# EAGLE design wifi (EAGLE 6.1)
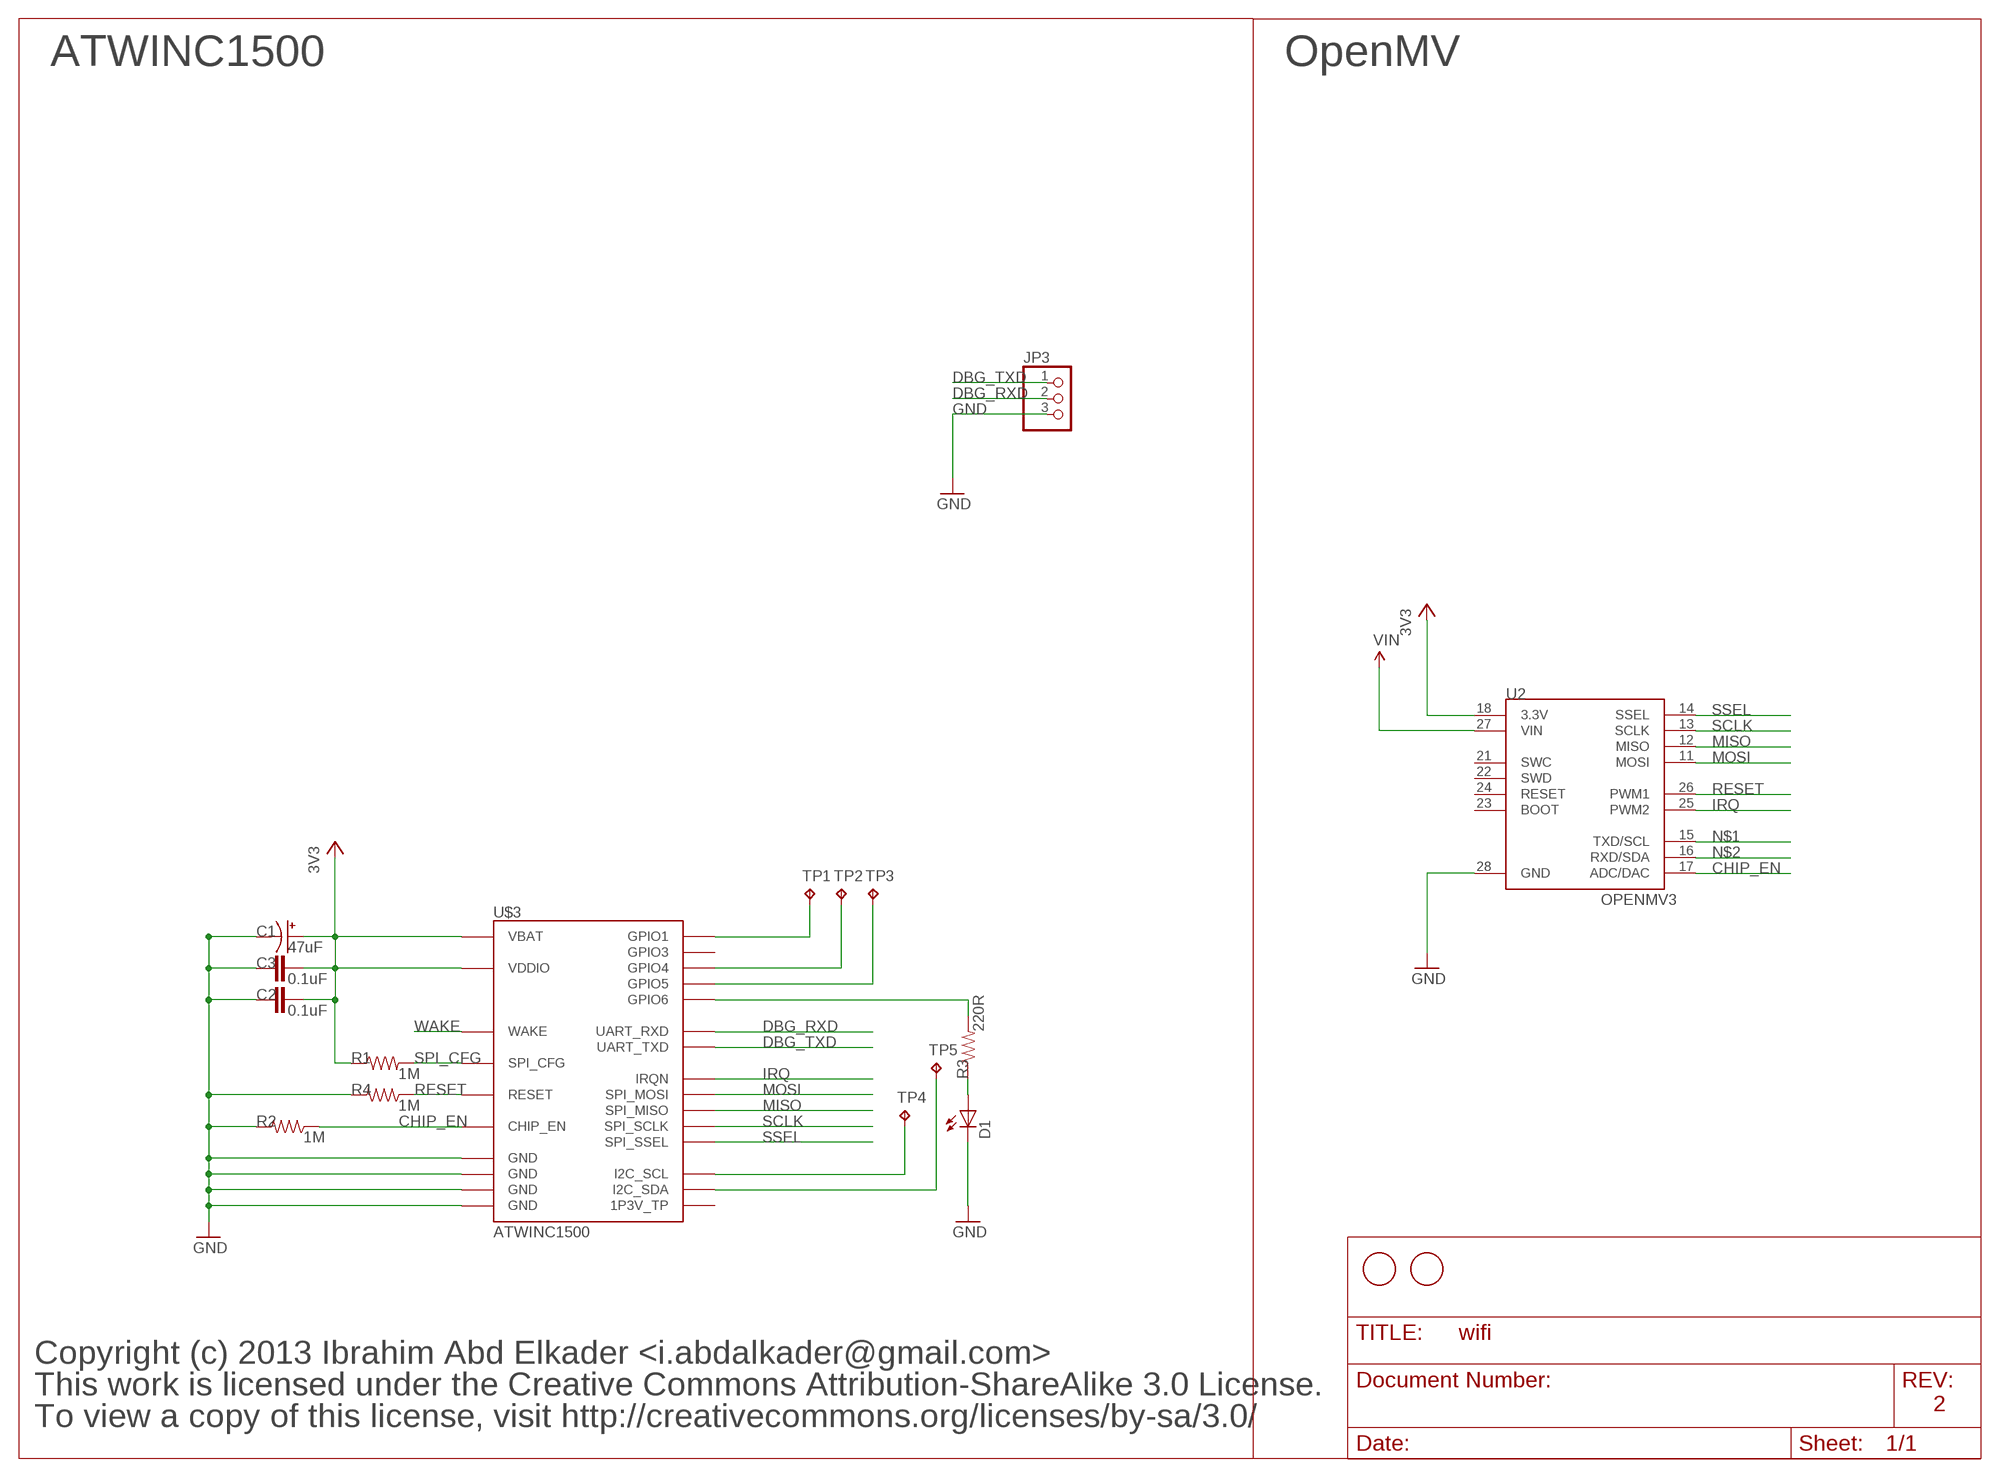
[diagram p0: schematic, sheet 1]

## Parts
C1  47uF  CAP_POL1206  [EIA3216]
C2  0.1uF  CAP0603-CAP  [0603-CAP]
C3  0.1uF  CAP0603-CAP  [0603-CAP]
D1  LED0603  [LED-0603]
JP3  PINHD-1X3  [1X03]
R1  1M  RESISTOR0603-RES  [0603-RES]
R2  1M  RESISTOR0603-RES  [0603-RES]
R3  220R  RESISTOR0603-RES  [0603-RES]
R4  1M  RESISTOR0603-RES  [0603-RES]
TP1  TPTP12R  [TP12R]
TP2  TPTP11R  [TP11R]
TP3  TPTP11R  [TP11R]
TP4  TPTP12R  [TP12R]
TP5  TPTP12R  [TP12R]
U2  OPENMV3  [OPENMV3]
U$1  FIDUCIAL  [FIDUCIAL_1MM]
U$2  FIDUCIAL  [FIDUCIAL_1MM]
U$3  ATWINC1500  [ATWINC1500]

## Nets
3V3: C1.A(+) C2.2 C3.2 R1.1 U2.18(3.3V) U$3.P$20(VBAT) U$3.P$23(VDDIO)
CHIP_EN: R2.1 U2.17(ADC/DAC) U$3.P$22(CHIP_EN)
DBG_RXD: JP3.2 U$3.P$19(UART_RXD)
DBG_TXD: JP3.1 U$3.P$14(UART_TXD)
GND: C1.C(-) C2.1 C3.1 D1.C JP3.3 R2.2 R4.2 U2.28(GND) U$3.P$9(GND) U$3.P$12(GND) U$3.P$28(GND) U$3.P$29(GND)
IRQ: U2.25(PWM2) U$3.P$13(IRQN)
MISO: U2.12(MISO) U$3.P$17(SPI_MISO)
MOSI: U2.11(MOSI) U$3.P$15(SPI_MOSI)
N$1: U2.15(TXD/SCL)
N$2: U2.16(RXD/SDA)
N$9: TP1.TP U$3.P$21(GPIO1)
N$10: TP4.TP U$3.P$2(I2C_SCL)
N$11: TP5.TP U$3.P$3(I2C_SDA)
N$12: D1.A R3.1
N$13: TP2.TP U$3.P$26(GPIO4)
N$14: TP3.TP U$3.P$27(GPIO5)
N$15: R3.2 U$3.P$1(GPIO6)
RESET: R4.1 U2.26(PWM1) U$3.P$4(RESET)
SCLK: U2.13(SCLK) U$3.P$18(SPI_SCLK)
SPI_CFG: R1.2 U$3.P$10(SPI_CFG)
SSEL: U2.14(SSEL) U$3.P$16(SPI_SSEL)
VIN: U2.27(VIN)
WAKE: U$3.P$11(WAKE)
Unconnected: U2.21(SWC) U2.22(SWD) U2.23(BOOT) U2.24(RESET) U$3.P$24(1P3V_TP) U$3.P$25(GPIO3)

## Notes on the sheet
- ATWINC1500 | OpenMV
- Copyright (c) 2013 Ibrahim Abd Elkader <i.abdalkader@gmail.com>
- This work is licensed under the Creative Commons Attribution-ShareAlike 3.0 License.
- 2
- To view a copy of this license, visit http://creativecommons.org/licenses/by-sa/3.0/

## Library data of the parts
C1 = sfe:CAP_POL: Capacitor Polarized These are standard SMD and PTH capacitors. Normally 10uF, 47uF, and 100uF in electrolytic and tantalum varieties. Always verify the external diameter of the through hole cap, it varies with capacity, voltage, and manufacturer. The EIA devices should be standard.
C2 C3 = sfe:CAP: Capacitor Standard 0603 ceramic capacitor, and 0.1" leaded capacitor.
D1 = sfe:LED: LEDs Standard schematic elements and footprints for 5mm, 3mm, 1206, and 0603 sized LEDs. 5mm - Spark Fun Electronics SKU : COM-00529 (and others)
JP3 = adafruit-updated:PINHD-1X3: PIN HEADER
R1-R4 = sfe:RESISTOR: Resistor Basic schematic elements and footprints for 0603, 1206, and PTH resistors.
TP1-TP5 = testpad:TP: Test pad
U2 = openmv:OPENMV3
U$1 U$2 = adafruit:FIDUCIAL: For use by pick and place machines to calibrate the vision/machine, 1mm By microbuilder.eu
U$3 = mux:ATWINC1500

## Net classes
1 vcc: width 1.016 mm, clearance 0.203 mm
2 antenna: width 0.363 mm, clearance 0.305 mm
3 1.8v: width 0.457 mm, clearance 0.254 mm

## Board
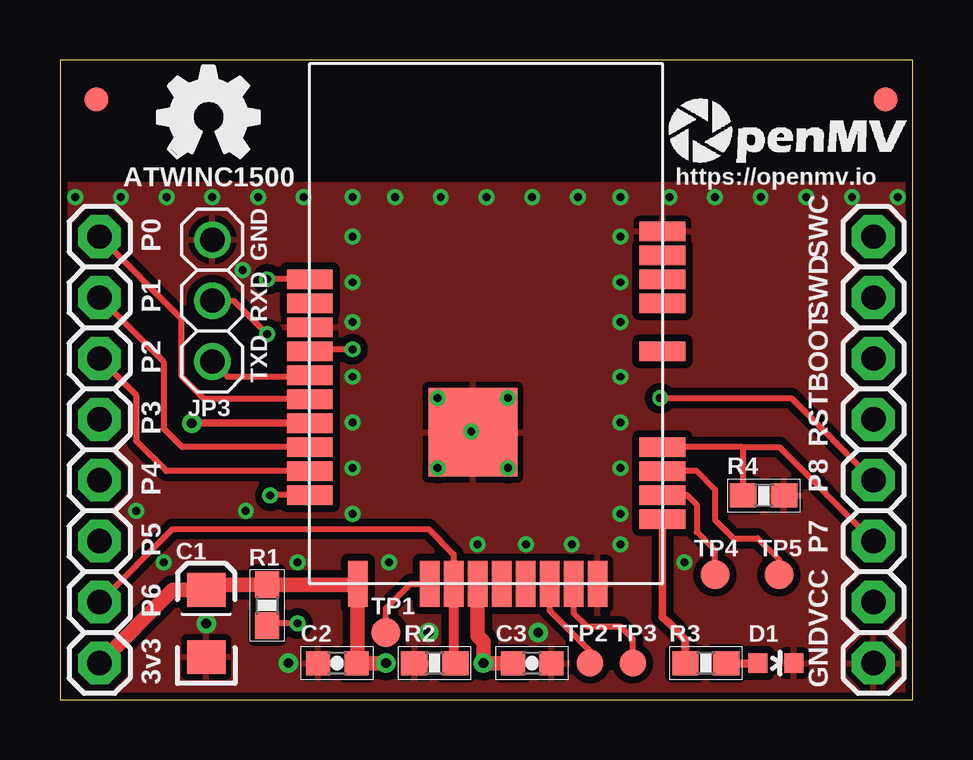
[diagram p1: board, top side]
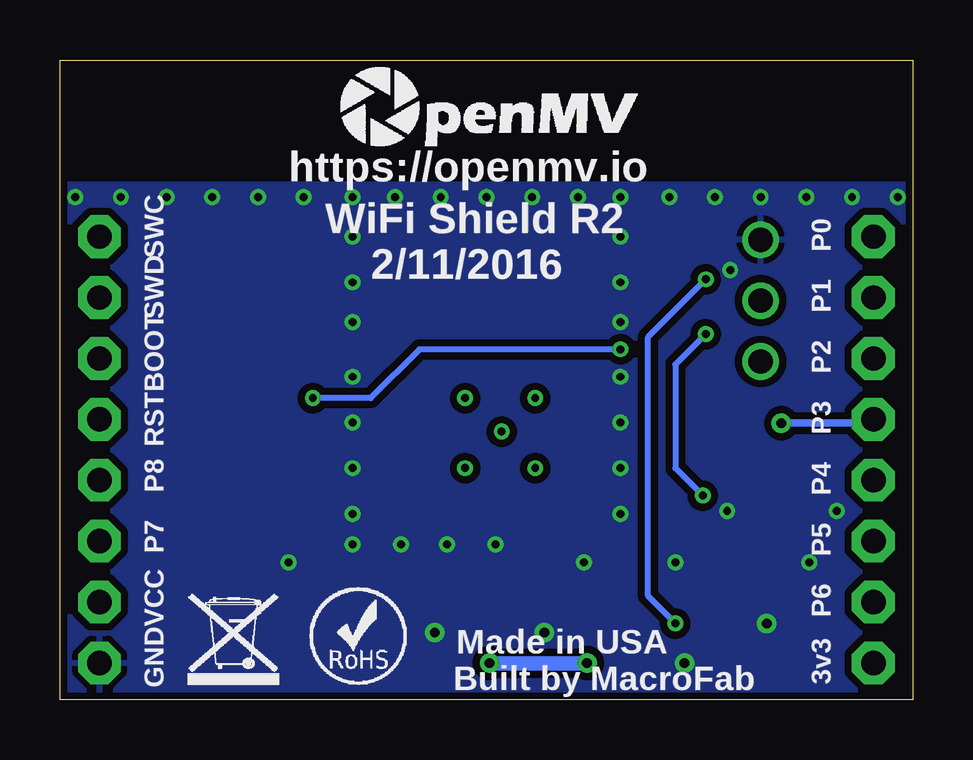
[diagram p2: board, bottom side, seen from below]

Size 35.56 x 26.67 mm. Coordinates in mm from the lower left corner, seen from the top.
Outline: 0,0 35.56,0 35.56,26.67 0,26.67 0,0
Copper layers (1*16): Top 0.035mm / dielectric 1.5mm / Bottom 0.035mm
Design rules: minimum track width 8mil, minimum drill 13mil, track to track 6mil, track to pad 6mil, pad to pad 6mil, via to via 6mil, smd to smd 6mil, copper to edge 5mil, drill to drill 10mil, minimum pad ring 10mil, minimum via ring 4mil, stop-mask expansion 2mil, vias tented up to drill 40mil, thermal gap 10mil

### Footprints (pad centres in the part's own frame; a part is rotated, then mirrored left to right if it is on the bottom)
EIA3216 = smd 1.4 x 1.6: A 1.4,0; C -1.4,0
0603-CAP = smd 1 x 1: 1 -0.8,0; 2 0.8,0
LED-0603 = smd 0.8 x 0.8: A 0,-0.75; C 0,0.75
1X03 = drill 1.016: 1 -2.54,0; 2 0,0; 3 2.54,0
0603-RES = smd 1.1 x 1: 1 -0.85,0; 2 0.85,0
TP12R = smd 1.2 x 1.2: TP 0,0
TP11R = smd 1.1 x 1.1: TP 0,0
OPENMV3 = drill 1.016 pad 1.778 octagon: 11 1.651,19.304; 12 1.651,16.764; 13 1.651,14.224; 14 1.651,11.684; 15 1.651,9.144; 16 1.651,6.604; 17 1.651,4.064; 18 1.651,1.524; 21 33.909,19.304; 22 33.909,16.764; 23 33.909,14.224; 24 33.909,11.684; 25 33.909,9.144; 26 33.909,6.604; 27 33.909,4.064; 28 33.909,1.524
FIDUCIAL_1MM = smd 1 x 1: 1 0,0
ATWINC1500 = smd 1.9 x 0.8: P$1 14.7,2.7; P$2 14.7,3.7; P$3 14.7,4.7; P$4 14.7,5.7; P$5 14.7,9.7; P$6 14.7,11.7; P$7 14.7,12.7; P$8 14.7,13.7; P$9 14.7,14.7; P$10 0,12.7; P$11 0,11.7; P$12 0,10.7; P$13 0,9.7; P$14 0,8.7; P$15 0,7.7; P$16 0,6.7; P$17 0,5.7; P$18 0,4.7; P$19 0,3.7 | smd 0.8 x 1.9: P$20 2,0; P$21 5,0; P$22 6,0; P$23 7,0; P$24 8,0; P$25 9,0; P$26 10,0; P$27 11,0; P$28 12,0 | smd 3.7 x 3.7: P$29 6.8,6.32

### Placement (x,y rotation side)
C1  6.1,3.17 90 top
C2  11.56,1.52 0 top
C3  19.68,1.52 180 top
D1  29.84,1.52 270 top
JP3  6.35,16.64 90 top
R1  8.64,3.94 270 top
R2  15.62,1.52 180 top
R3  26.92,1.52 180 top
R4  29.34,8.51 0 top
TP1  13.59,2.79 0 top
TP2  22.1,1.52 0 top
TP3  23.88,1.52 0 top
TP4  27.3,5.21 0 top
TP5  29.97,5.21 0 top
U2  0,0 0 top
U$1  1.52,25.02 0 top
U$2  34.42,25.02 0 top
U$3  10.41,4.83 0 top
U$4  [OMV-LOGO]  24,22.86 0 bottom
U$5  [ROHS]  25.15,0.64 0 bottom
U$6  [WEEE]  30.23,0.64 0 bottom
U$7  [OSHW_FILLX150_NOTEXT]  4.06,22.61 0 top
U$10  [OMV-LOGO-SMALL]  25.27,22.23 0 top

### Tracks (layer width: path | path; a pad name or v marks a point on that pad's centre or on a via)
3V3  (via drill 0.41)
  Top 0.61: C3.2 v17.65,1.52 17.65,2.41 17.41,2.65 U$3.P$23 | v13.59,1.52 C2.2 12.41,1.58 U$3.P$20 12.38,4.79 R1.1 6.31,4.79 C1.A 4.7,4.58 U2.18
  Bottom 0.61: v17.65,1.52 v13.59,1.52
CHIP_EN
  Top 0.254: U2.17 4.7,7.11 15.37,7.11 16.41,6.07 U$3.P$22
  Top 0.406: U$3.P$22 16.41,1.58 R2.1
DBG_RXD  (via drill 0.33)
  Top 0.254: U$3.P$19 8.78,8.53 v8.76,8.51 | JP3.2 7.24,16.64 v8.64,15.24
  Bottom 0.254: v8.76,8.51 9.91,9.65 9.91,13.97 v8.64,15.24
DBG_TXD
  Top 0.254: JP3.1 6.99,13.46 10.35,13.46 U$3.P$14
GND  (via drill 0.33, 0.41)
  other vias: 26.04,5.71 4.32,5.71 6.1,3.17 2.54,20.95 4.45,20.95 6.35,20.95 8.26,20.95 10.16,20.95 12.19,20.95 13.97,20.95 21.59,20.95 23.37,20.95 25.4,20.95 27.3,20.95 29.21,20.95 31.11,20.95 34.92,20.95 33.02,20.95 19.68,20.95 17.78,20.95 15.88,20.95 0.64,20.95 23.37,19.3 12.19,19.3 23.37,9.65 23.37,7.75 3.17,7.87 19.94,2.79 13.72,5.71 12.19,11.56 23.37,13.46 23.37,17.4 23.37,15.75 12.19,17.4 12.19,15.75 12.19,9.65 23.37,11.56 9.91,5.71 12.19,7.75 12.19,13.46 7.62,17.91 17.4,6.48 7.75,7.87 19.43,6.48 21.34,6.48 23.37,6.48 9.53,1.52 15.37,2.79
  pour Top (isolate 0.305, rank 2): 0,0 0,21.46 35.56,21.46 35.56,0
  pour Bottom (isolate 0.305, rank 2): 0,0 0,21.46 35.56,21.46 35.56,0
IRQ  (via drill 0.33)
  Top 0.254: v25.02,12.57 30.48,12.57 U2.25 | v12.19,14.61 10.49,14.61 U$3.P$13
  Bottom 0.254: v12.19,14.61 20.57,14.61 22.61,12.57 v25.02,12.57
MISO
  Top 0.254: U2.12 4.32,14.1 4.32,11.3 5.09,10.53 U$3.P$17
MOSI
  Top 0.254: U2.11 5.08,15.88 5.08,13.46 5.71,12.83 6.02,12.53 U$3.P$15
N$3  (via drill 0.33)
  other vias: 18.67,12.57
N$4  (via drill 0.33)
  other vias: 15.75,12.57
N$5  (via drill 0.33)
  other vias: 15.75,9.65
N$6  (via drill 0.33)
  other vias: 18.67,9.65
N$7  (via drill 0.33)
  other vias: 17.14,11.18
N$9
  Top 0.254: TP1.TP 13.59,3.81 14.61,4.83 U$3.P$21
N$10
  Top 0.254: TP4.TP 27.3,6.22 26.54,6.99 26.54,8.13 26.14,8.53 U$3.P$2
N$11
  Top 0.254: TP5.TP 29.97,5.84 29.08,6.73 28.07,6.73 27.3,7.49 27.3,8.76 26.54,9.53 U$3.P$3
N$12
  Top 0.33: R3.1 D1.A
N$13
  Top 0.254: U$3.P$26 20.41,3.72 22.1,2.03 TP2.TP
N$14
  Top 0.254: TP3.TP 23.88,2.54 23.37,3.05 21.97,3.05 21.41,3.6 U$3.P$27
N$15
  Top 0.305: U$3.P$1 25.11,3.46
  Top 0.33: 25.11,3.46 25.34,3.24 26.07,2.5 R3.2
RESET
  Top 0.254: 28.45,10.53 29.99,10.53 U2.26 | R4.1 28.49,10.49 28.45,10.53 | 28.45,10.53 U$3.P$4
SCLK
  Top 0.254: U2.13 3.17,12.7 3.17,10.79 4.44,9.53 U$3.P$18
SPI_CFG  (via drill 0.33)
  Top 0.254: v9.91,3.17 8.72,3.17 R1.2 | U$3.P$10 v8.64,17.53
  Bottom 0.254: v9.91,3.17 11.05,4.32 11.05,15.11 v8.64,17.53
SSEL  (via drill 0.41)
  Top 0.305: U$3.P$16 v5.49,11.53
  Bottom 0.305: v5.49,11.53 1.81,11.53 U2.14

### Text on the board
tPlace: ATWINC1500 | https://openmv.io | P0 | GND | SWC | P1 | RXD | SWD | P2 | TXD | BOOT | P3 | RST | P4 | P8 | P5 | P7 | P6 | VCC | 3v3 | GND
bPlace: https://openmv.io | P0 | WiFi Shield R2 | 2/11/2016 | SWC | P1 | SWD | P2 | BOOT | P3 | RST | P4 | P8 | P5 | P7 | P6 | VCC | Made in USA | 3v3 | GND | Built by MacroFab